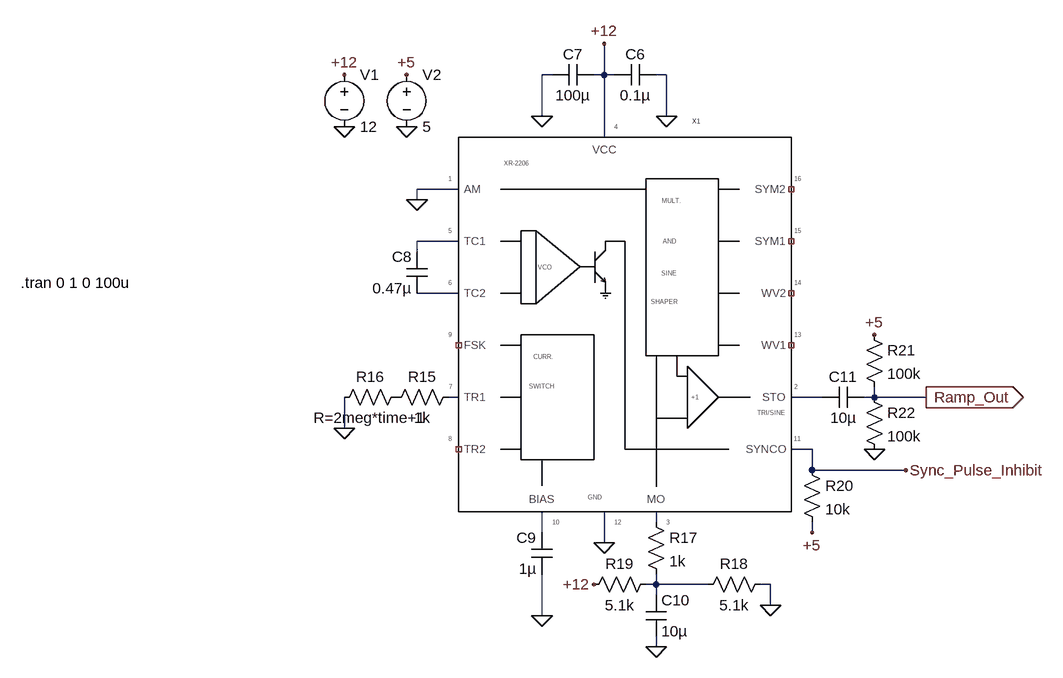
[diagram p0: schematic Simulacion Chirp.asc]
Simulacion Chirp.asc, the LTspice schematic file:
Version 4
SHEET 1 1532 1460
WIRE 352 496 336 496
WIRE 432 496 432 448
WIRE 432 496 416 496
WIRE 448 496 432 496
WIRE 528 496 512 496
WIRE 336 560 336 496
WIRE 528 560 528 496
WIRE 432 592 432 496
WIRE 208 672 144 672
WIRE 144 688 144 672
WIRE 208 752 144 752
WIRE 144 768 144 752
WIRE 208 832 144 832
WIRE 208 992 192 992
WIRE 768 992 720 992
WIRE 848 992 848 976
WIRE 848 992 832 992
WIRE 928 992 848 992
WIRE 32 1040 32 992
WIRE 752 1072 720 1072
WIRE 752 1104 752 1072
WIRE 896 1104 752 1104
WIRE 512 1184 512 1168
WIRE 336 1200 336 1168
WIRE 752 1200 752 1184
WIRE 432 1216 432 1168
WIRE 512 1280 512 1264
WIRE 512 1280 496 1280
WIRE 592 1280 512 1280
WIRE 688 1280 672 1280
WIRE 512 1296 512 1280
WIRE 688 1312 688 1280
WIRE 336 1328 336 1264
WIRE 512 1376 512 1360
FLAG 128 576 0
FLAG 32 576 0
FLAG 32 496 +12
FLAG 128 496 +5
FLAG 928 992 Ramp_Out
IOPIN 928 992 Out
FLAG 432 448 +12
FLAG 336 560 0
FLAG 528 560 0
FLAG 144 688 0
FLAG 32 1040 0
FLAG 336 1328 0
FLAG 432 1216 0
FLAG 512 1376 0
FLAG 416 1280 +12
FLAG 688 1312 0
FLAG 752 1200 +5
FLAG 896 1104 Sync_Pulse_Inhibit
FLAG 848 896 +5
FLAG 848 1072 0
SYMBOL voltage 32 480 R0
WINDOW 123 0 0 Left 2
WINDOW 39 0 0 Left 2
SYMATTR InstName V1
SYMATTR Value 12
SYMBOL voltage 128 480 R0
WINDOW 123 0 0 Left 2
WINDOW 39 0 0 Left 2
SYMATTR InstName V2
SYMATTR Value 5
SYMBOL XR2206 304 752 R0
SYMATTR InstName X1
SYMBOL cap 512 480 R90
WINDOW 0 0 32 VBottom 2
WINDOW 3 32 32 VTop 2
SYMATTR InstName C6
SYMATTR Value 0.1µ
SYMBOL cap 416 480 R90
WINDOW 0 0 32 VBottom 2
WINDOW 3 32 32 VTop 2
SYMATTR InstName C7
SYMATTR Value 100µ
SYMBOL cap 160 832 R180
WINDOW 0 24 56 Left 2
WINDOW 3 24 8 Left 2
SYMATTR InstName C8
SYMATTR Value 0.47µ
SYMBOL res 208 976 R90
WINDOW 0 0 56 VBottom 2
WINDOW 3 32 56 VTop 2
SYMATTR InstName R15
SYMATTR Value 1k
SYMBOL res 128 976 R90
WINDOW 0 0 56 VBottom 2
WINDOW 3 32 56 VTop 2
SYMATTR InstName R16
SYMATTR Value R=2meg*time+1
SYMBOL cap 352 1264 R180
WINDOW 0 24 56 Left 2
WINDOW 3 24 8 Left 2
SYMATTR InstName C9
SYMATTR Value 1µ
SYMBOL res 496 1168 R0
SYMATTR InstName R17
SYMATTR Value 1k
SYMBOL res 688 1264 R90
WINDOW 0 0 56 VBottom 2
WINDOW 3 32 56 VTop 2
SYMATTR InstName R18
SYMATTR Value 5.1k
SYMBOL res 512 1264 R90
WINDOW 0 0 56 VBottom 2
WINDOW 3 32 56 VTop 2
SYMATTR InstName R19
SYMATTR Value 5.1k
SYMBOL cap 496 1296 R0
SYMATTR InstName C10
SYMATTR Value 10µ
SYMBOL cap 832 976 R90
WINDOW 0 0 32 VBottom 2
WINDOW 3 32 32 VTop 2
SYMATTR InstName C11
SYMATTR Value 10µ
SYMBOL res 832 880 R0
SYMATTR InstName R21
SYMATTR Value 100k
SYMBOL res 832 976 R0
SYMATTR InstName R22
SYMATTR Value 100k
SYMBOL res 736 1088 R0
SYMATTR InstName R20
SYMATTR Value 10k
TEXT -466 816 Left 2 !.tran 0 1 0 100u

The netlist it stands for:
* Simulacion Chirp.asc
V1 +12 0 12
V2 +5 0 5
XX1 0 N004 N005 +12 N001 N002 N003 NC_01 NC_02 N006 Sync_Pulse_Inhibit 0 NC_03 NC_04 NC_05 NC_06 XR2206  ; pins AM STO MO VCC TC1 TC2 TR1 TR2 FSK BIAS SYNCO COM WV1 WV2 SYM1 SYM2
C6 0 +12 0.1µ
C7 +12 0 100µ
C8 N002 N001 0.47µ
R15 N003 P001 1k
R16 P001 0 R=2meg*time+1
C9 0 N006 1µ
R17 N005 N007 1k
R18 0 N007 5.1k
R19 N007 +12 5.1k
C10 N007 0 10µ
C11 Ramp_Out N004 10µ
R21 +5 Ramp_Out 100k
R22 Ramp_Out 0 100k
R20 Sync_Pulse_Inhibit +5 10k
.tran 0 1 0 100u
.lib XR2206.sub
.backanno
.end